# Altium schematic sheet 08 Serial RGB LCD.SchDoc
size 420 x 297 mm; Organization: Altium Limited; Address1: L3, 12a Rodborough Rd; Address2: Frenchs Forest; Address3: NSW; Address4: Australia 2086
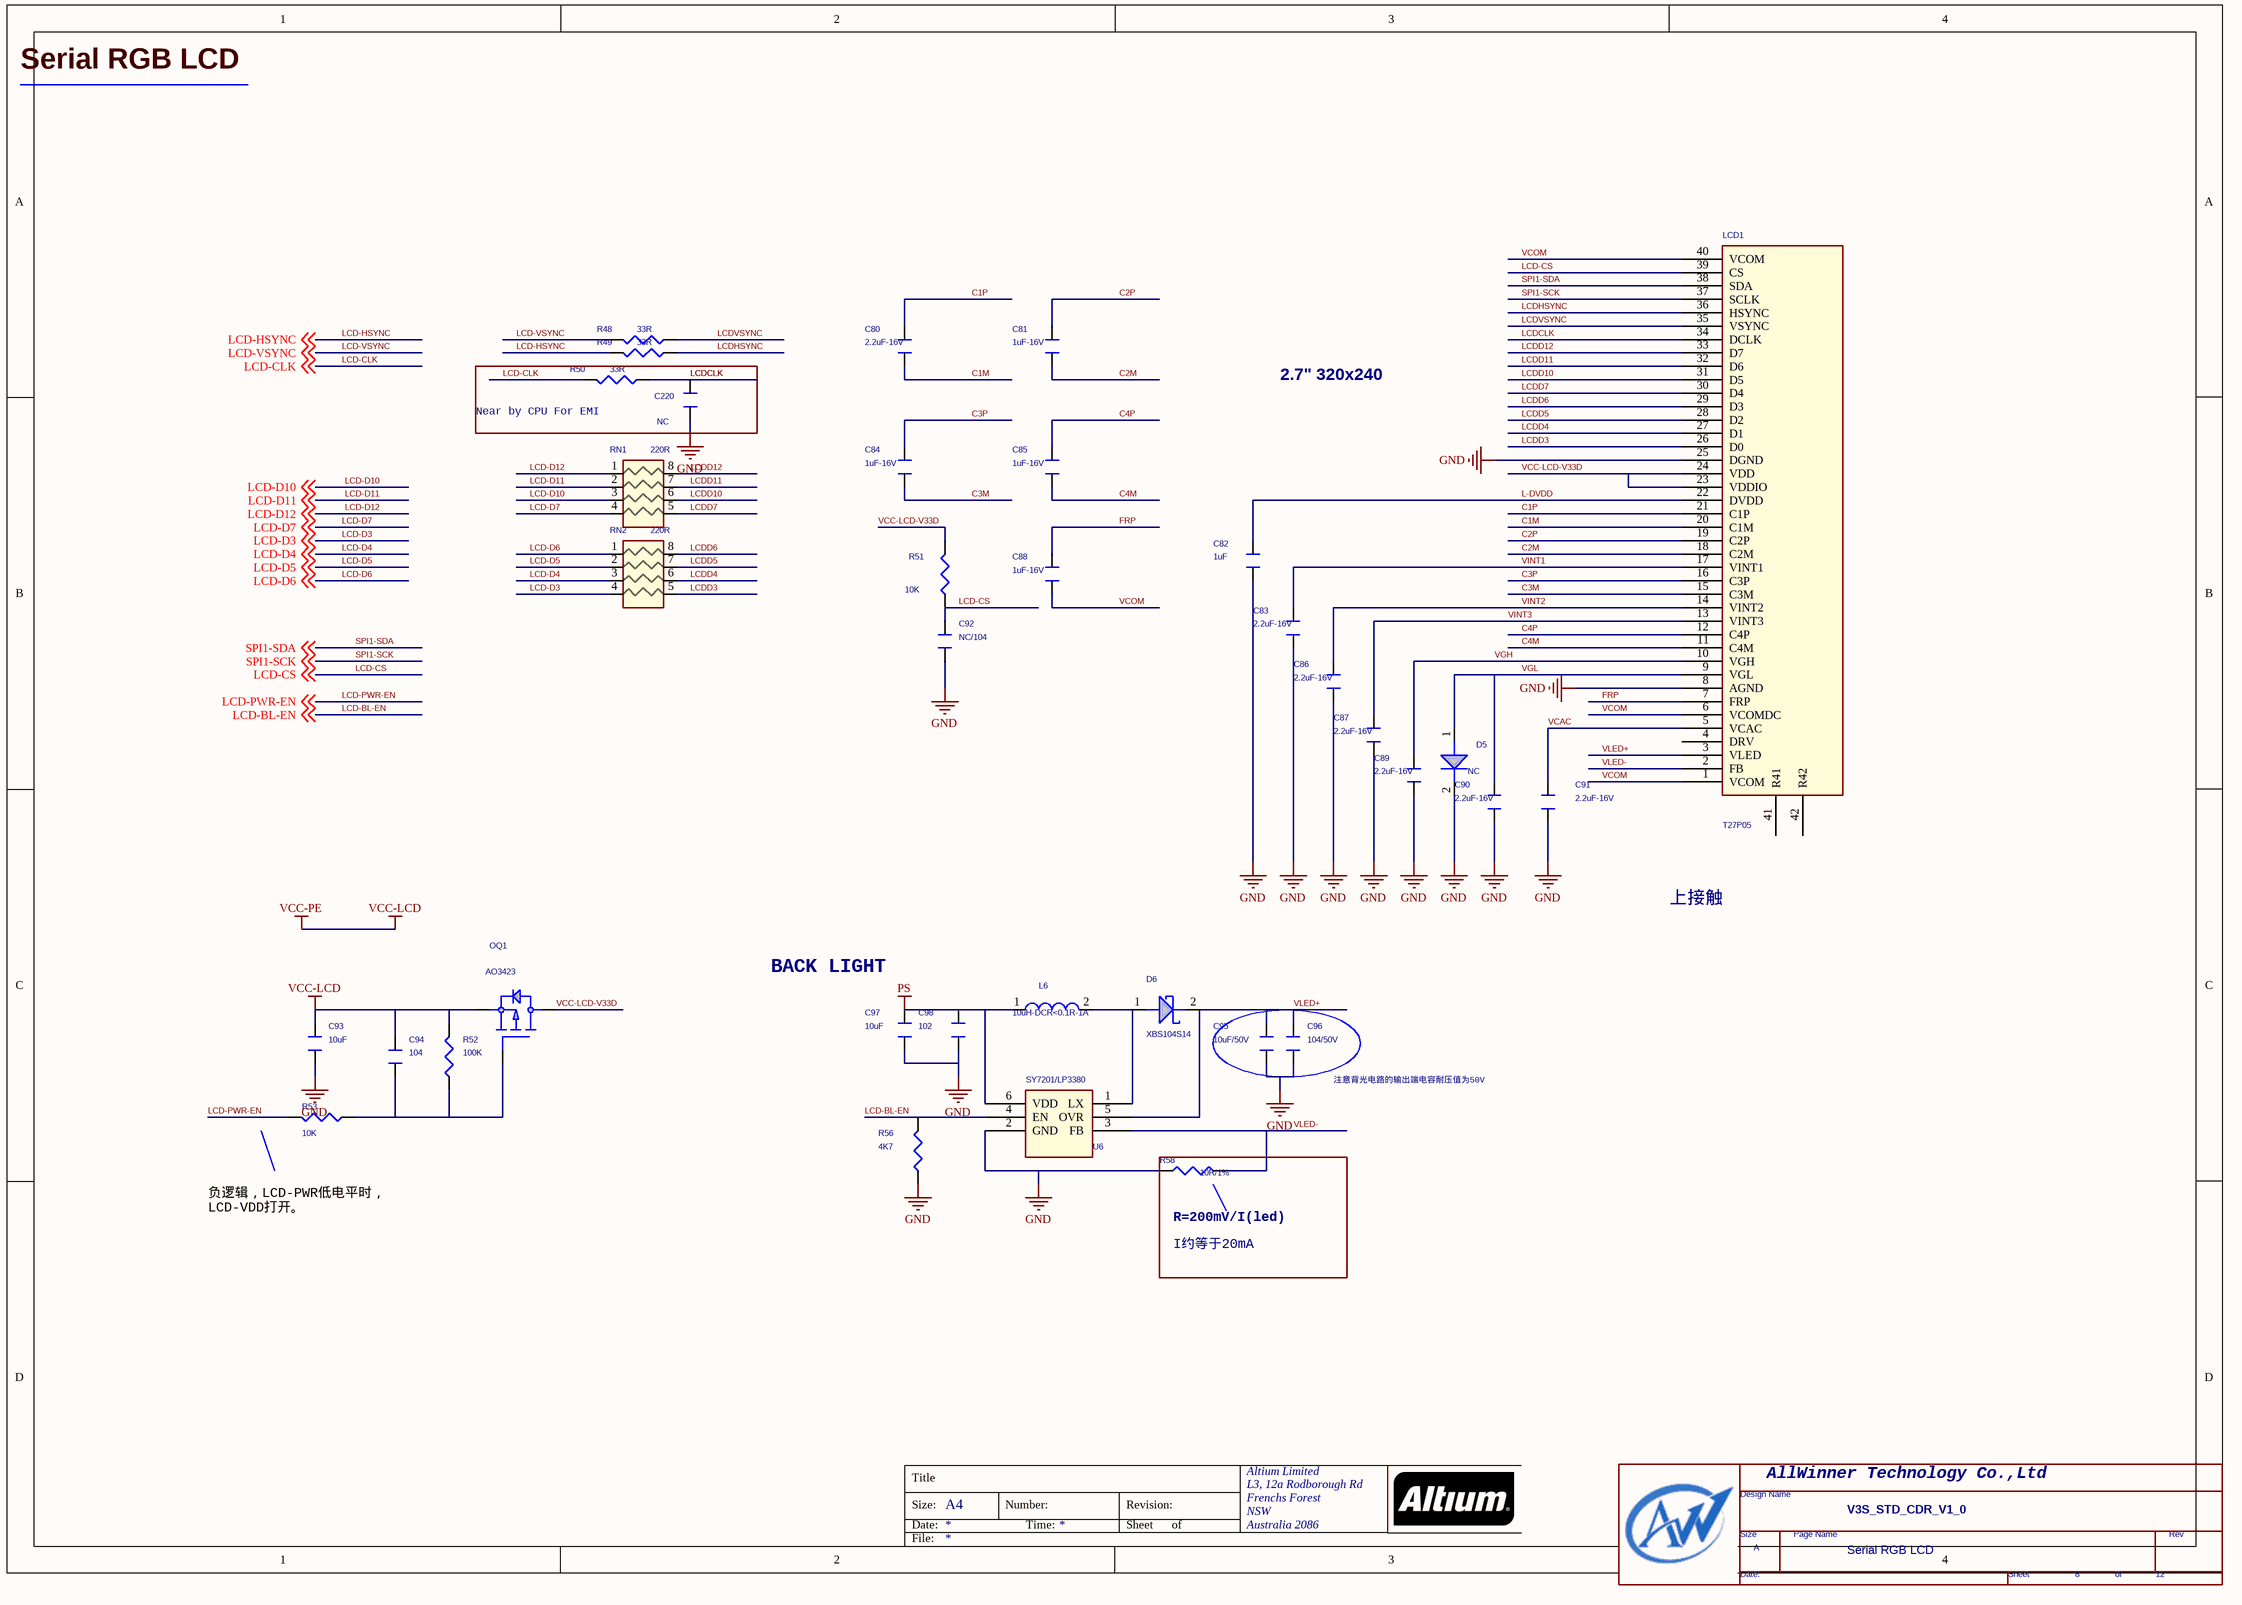
[diagram p0: 08 Serial RGB LCD.SchDoc]

## Parts
*  Page Count: 12  Page Number: 8  Page Size: A  Title: V3S_STD_CDR_V1_0  Doc: Serial RGB LCD  (hidden comment: TitleBlock0-AW)  (graphical)
C80  2.2uF-16V  [C0402]
C81  1uF-16V  [C0402]
C82  1uF  [C0402]
C83  2.2uF-16V  [C0402]
C84  1uF-16V  [C0402]
C85  1uF-16V  [C0402]
C86  2.2uF-16V  [C0402]
C87  2.2uF-16V  [C0402]
C88  1uF-16V  [C0402]
C89  2.2uF-16V  [C0402]
C90  2.2uF-16V  [C0402]
C91  2.2uF-16V  [C0402]
C92  NC/104  [C0402]
C93  10uF  [C0603]
C94  104  [C0402]
C95  10uF/50V  [C0805]
C96  104/50V  [C0603]
C97  10uF  [C0603]
C98  102  [C0402]
C220  NC  [C0402]
D5  NC  [SOD123]
D6  XBS104S14  [SOD123]
L6  10uH-DCR<0.1R-1A  [CD32]
LCD1  T27P05  [FPC40PIN-0.5MM]
OQ1  AO3423  [SOT-23]
R48  33R  [R0402]
R49  33R  [R0402]
R50  33R  [R0402]
R51  10K  [R0402]
R52  100K  [R0402]
R53  10K  [R0402]
R56  4K7  [R0402]
R58  10R/1%  [R0402]
RN1  220R  [RN0402]
RN2  220R  [RN0402]
U6  SY7201/LP3380  [SOT23-6]

## Blocks framed on the sheet
Near by CPU For EMI: C220 R50

## Nets
GND: C82.1 C83.1 C86.1 C87.1 C89.1 C90.1 C91.1 C92.1 C93.1 C95.1 C96.1 C97.1 C98.1 C220.2 D5.2 LCD1.8(AGND) LCD1.25(DGND) R56.1 R58.2 U6.2(GND)
PS: C97.2 C98.2 L6.1 U6.6(VDD)
VCC-LCD: C93.2 C94.2 OQ1.2(SOURCE) R52.2  [also labelled VCC-PE]
C1M: C80.1 LCD1.20(C1M)
C1P: C80.2 LCD1.21(C1P)
C2M: C81.1 LCD1.18(C2M)
C2P: C81.2 LCD1.19(C2P)
C3M: C84.1 LCD1.15(C3M)
C3P: C84.2 LCD1.16(C3P)
C4M: C85.1 LCD1.11(C4M)
C4P: C85.2 LCD1.12(C4P)
FRP: C88.2 LCD1.7(FRP)
L-DVDD: C82.2 LCD1.22(DVDD)
LCD-BL-EN: R56.2 U6.4(EN) ; off-sheet LCD-BL-EN
LCD-CLK: R50.2 ; off-sheet LCD-CLK
LCD-CS: C92.2 LCD1.39(CS) R51.2 ; off-sheet LCD-CS
LCD-D3: RN2.4 ; off-sheet LCD-D3
LCD-D4: RN2.3 ; off-sheet LCD-D4
LCD-D5: RN2.2 ; off-sheet LCD-D5
LCD-D6: RN2.1 ; off-sheet LCD-D6
LCD-D7: RN1.4 ; off-sheet LCD-D7
LCD-D10: RN1.3 ; off-sheet LCD-D10
LCD-D11: RN1.2 ; off-sheet LCD-D11
LCD-D12: RN1.1 ; off-sheet LCD-D12
LCD-HSYNC: R49.2 ; off-sheet LCD-HSYNC
LCD-PWR-EN: R53.2 ; off-sheet LCD-PWR-EN
LCD-VSYNC: R48.2 ; off-sheet LCD-VSYNC
LCDCLK: C220.1 LCD1.34(DCLK) R50.1
LCDD3: LCD1.26(D0) RN2.5
LCDD4: LCD1.27(D1) RN2.6
LCDD5: LCD1.28(D2) RN2.7
LCDD6: LCD1.29(D3) RN2.8
LCDD7: LCD1.30(D4) RN1.5
LCDD10: LCD1.31(D5) RN1.6
LCDD11: LCD1.32(D6) RN1.7
LCDD12: LCD1.33(D7) RN1.8
LCDHSYNC: LCD1.36(HSYNC) R49.1
LCDVSYNC: LCD1.35(VSYNC) R48.1
SPI1-SCK: LCD1.37(SCLK) ; off-sheet SPI1-SCK
SPI1-SDA: LCD1.38(SDA) ; off-sheet SPI1-SDA
VCAC: C91.2 LCD1.5(VCAC)
VCC-LCD-V33D: LCD1.23(VDDIO) LCD1.24(VDD) OQ1.3(DRAIN) R51.1
VCOM: C88.1 LCD1.1(VCOM) LCD1.6(VCOMDC) LCD1.40(VCOM)
VGH: C89.2 LCD1.10(VGH)
VGL: C90.2 D5.1 LCD1.9(VGL)
VINT1: C83.2 LCD1.17(VINT1)
VINT2: C86.2 LCD1.14(VINT2)
VINT3: C87.2 LCD1.13(VINT3)
VLED+: C95.2 C96.2 D6.2 LCD1.3(VLED) U6.5(OVR)
VLED-: LCD1.2(FB) R58.1 U6.3(FB)
NetC94_1: C94.1 OQ1.1(GATE) R52.1 R53.1
NetD6_1: D6.1 L6.2 U6.1(LX)

Not connected (* = marked no-connect by the designer): LCD1 4(DRV) 41(R41) 42(R42)

## Notes on the sheet
- Serial RGB LCD
- 2.7" 320x240
- 上接触
- BACK LIGHT
- 注意背光电路的输出端电容耐压值为50V
- 负逻辑，LCD-PWR低电平时，
  LCD-VDD打开。
- (near R58) R=200mV/I(led)
- I约等于20mA
- Title
- Size:
- Date:
- A4
- Number:
- Time:
- Revision:
- Sheet
- of
- File:
- (in symbol TitleBlock0-AW) AllWinner Technology Co.,Ltd; Design Name; Size; Page Name; Rev; Date:; Sheet; of

## Library data of the parts
* = TitleBlock0-AW: RevCode: 0.1; Page Create Date: March  8, 1995
C80 C82-C84 C87 C97 C98 = CAPACITOR_0_Dup5: mypage: 09; Page: 10
C81 C85 C86 C88-C91 C95 C96 = CAPACITOR_0_Dup5: Page: 10; mypage: 09
C92-C94 = CAPACITOR_Dup1: Page: 10
C220 = CAPACITOR_1: ROOM: DCDC; PAGE: 5
D5 = DIODE SCHOTTKY_0_Dup1: Value2: NC
D6 = DIODE SCHOTTKY: RoHS 1.0 Ampere Schottky Barrier Rectifiers  SOD-123; Page: 10
L6 = INDUCTOR: RoHS Power Inductor 22uH 300mA H<1.8MM,CD32; mypage: 09; Page: 10
LCD1 = LCD-TD043MGEB1_0
OQ1 = PMOS: Page: 10
R48-R50 = R_Dup4
R51 = RESISTOR_5: Page: 10
R52 R53 = R_Dup3: Page: 10
R56 = RESISTOR_Dup2: Page: 10; mypage: 09
R58 = RESISTOR_Dup2: mypage: 09; Page: 10
RN1 RN2 = 742C083/SM_0
U6 = AP3031: Page: 10